# Altium schematic sheet CommonComponents.SchDoc
size Letter; SheetNumber: 7; SheetTotal: 7
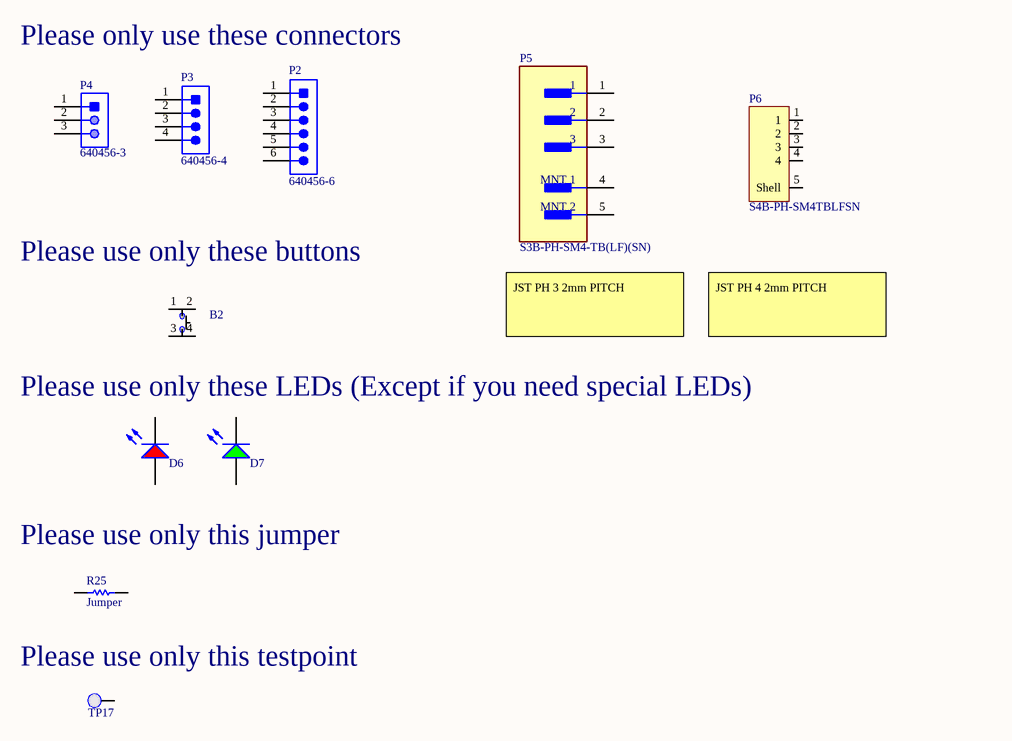
[diagram p0: CommonComponents.SchDoc]

## Parts
B2  PTS810SJK250SMTRLFS  [PTS810SJK250SMTRLFS-Footprint-1]  (value not drawn)
D6  LSM0805412V  [LED_0805_RED]  (value not drawn)
D7  LSM0805452V  [LED_0805]  (value not drawn)
P2  640456-6  [TECO-640456-6_V]
P3  640456-4  [TECO-640456-4]
P4  640456-3  [TECO-640456-3]
P5  S3B-PH-SM4-TB(LF)(SN)  [FP-S3B-PH-SM4-TB_LF_SN-MFG]
P6  S4B-PH-SM4TBLFSN  [S4B-PH-SM4TBLFSN-Footprint-1]
R25  Jumper  [0805_RES]
TP17  Test Point 0.1"  [Test Point 0.1"-Footprint-1]  (value not drawn)

## Nets

Not connected (* = marked no-connect by the designer): B2 1 2 3 4; D6 A K; D7 A K; P2 1 2 3 4 5 6; P3 1 2 3 4; P4 1 2 3; P5 1 2 3 4(MNT_1) 5(MNT_2); P6 1 2 3 4 5(Shell); R25 1 2; TP17 1(PAD)

## Notes on the sheet
- Please only use these connectors
- (near B2) Please use only these buttons
- JST PH 3 2mm PITCH
- JST PH 4 2mm PITCH
- Please use only these LEDs (Except if you need special LEDs)
- Please use only this jumper
- (near TP17) Please use only this testpoint
- Title:
- Desc:
- Size:
- Letter
- Auth:
- Proj:
- Sheet
- of
- www.seas.upenn.edu
- Electrical and Systems Engineering

## Library data of the parts
B2 = CMP-00084-1: Keypad Switch, 1 Switches, SPST, Momentary-tactile, 0.05A, 16VDC, 3.23N, Solder Terminal, Surface Mount-straight; Manufacturer Series: PTS810; Actuator Length: 0.028inch; Electrical Life: 50000Cycles; Contact Resistance: 0.5mR; Solderability: REFLOW; Actuator Travel: 0.1524mm; Actuator Color: White; Actuator Type: Pushbutton; Insulation Resistance: 100MR; Dielectric Withstand Volts: 250VACV; Reach SVHC Compliant: Yes; Terminal Finish: Silver; Switch Type: Keypad; Switch Action: MOMENTARY; RoHS Compliant: Yes; JESD-609 Code: e4; Max Operating Temperature: 85°C; Termination: Solder; Min Operating Temperature: -40°C; Mounting Technology: Surface Mount; Switch Function: SPST
D6 = CMP-00026-00001-1: Single Color LED, RED, 0805; Test Current: 20mA; Forward Voltage: 2V; RoHS Compliant: Yes
D7 = CMP-00038-3: Single Color LED, Green, 0805; Test Current: 20mA; Forward Voltage: 2V; RoHS Compliant: Yes
P2 = CMP-2000-05661-1: Male Header, Pitch 2.54 mm, 1 x 6 Position, Height 10.03 mm, Tail Length 3.56 mm, -55 to 105 degC, Bulk; Manufacturer: TE Connectivity; Contact Centerline Spacing: 0.100 / in.; Number of Contacts: 6; Current, Rating: 5 / A; Agency Approvals: CSA,UL; Material, Contact: CopperAlloy; Mounting Hole Size: 0.04 / "; Brand/Series: MTA-100Series; Pin Spacing: 0.1 / "; Mount Angle: Vertical; Contact Termination Area Plating: Tin; Angle: Straight; Primary Type: InterconnectSystem; Standards: RoHSCompliant,ELVCompliant,UL94V-0; Temperature, Operating: -55to+105 / °C; Material, Housing: Polyester; Special Features: Pinstrip; Color, Housing: White; Connector Type: MTA-100; Voltage, Rating: 250 / V; Termination: Solder; Package Reference: 640456-6; Size, Post: 0.025 / in.; Color: White; Datasheet URL: https://datasheet.ciiva.com/25618/0900766b80eb7fdd-25618163.pdf; Manufacturer URL: http://www.te.com/; Mounting Type: PCMount; Length, Pin: 0.14 / "; Type: PCBPlug; Length, Overall: 0.6 / "; Mounting Technology: ThroughHole; Number of Rows: 1; Contact Shape: Square; Contact Mating Area Plating: Tin; Datasheet Version: Rev. W, 05/2005; Number of Positions: 6; Package Description: Male Header, Pitch 2.54 mm, 1 x 6 Position, Height 10.03 mm, Tail Length 3.56 mm; Contact Plating: Tin; Length, Terminal Post: 0.14 / in.; Flammability Rating: UL94V-0
P3 = CMP-2000-05419-1: Male Header, Pitch 2.54 mm, 1 x 4 Position, Height 10.03 mm, Tail Length 3.56 mm, RoHS, Bulk; Manufacturer: TE Connectivity; Material, Housing: Polyester; Primary Type: InterconnectSystem; Mount Angle: Vertical; Color, Housing: White; Current, Rating: 5 / A; Agency Approvals: CSA,UL; Contact Termination Area Plating: Tin; Temperature, Operating: -55to+105 / degC; Standards: RoHSCompliant,ELVCompliant,UL94V-0; Number of Positions: 4; Brand/Series: MTA-100Series; Angle: Straight; Pin Spacing: 0.1 / "; Material, Contact: CopperAlloy; Connector Type: MTA-100; Special Features: Pinstrip; Mounting Hole Size: 0.04 / "; Contact Centerline Spacing: 0.100 / in.; Voltage, Rating: 250 / V; Manufacturer URL: http://www.te.com/; Length, Pin: 0.14 / "; Length, Overall: 0.4 / "; Color: White; Flammability Rating: UL94V-0; Mounting Type: PCMount; Termination: Solder; Datasheet URL: https://datasheet.ciiva.com/16286/eng-ds-82056-mta-0608-16286228.pdf; Number of Contacts: 4; Contact Shape: Square; Contact Mating Area Plating: Tin; Length, Terminal Post: 0.14 / in.; Size, Post: 0.025 / in.; Contact Plating: Tin; Type: PCBPlug; Datasheet Version: Dec-14; Number of Rows: 1
P4 = CMP-2000-05418-1: Male Header, Pitch 2.54 mm, 1 x 3 Position, Height 10.03 mm, Tail Length 3.56 mm, -55 to 105 degC; Manufacturer: TE Connectivity; Agency Approvals: CSA,UL; Angle: Straight; Number of Positions: 3; Standards: RoHSCompliant,ELVCompliant,UL94V-0; Current, Rating: 5 / A; Connector Type: MTA-100; Mount Angle: Vertical; Material, Housing: Polyester; Temperature, Operating: -55to+105 / degC; Voltage, Rating: 250 / V; Color, Housing: White; Contact Centerline Spacing: 0.100 / in.; Special Features: Pinstrip; Material, Contact: CopperAlloy; Contact Termination Area Plating: Tin; Primary Type: InterconnectSystem; Pin Spacing: 0.1 / "; Brand/Series: MTA-100Series; Mounting Hole Size: 0.04 / "; Manufacturer URL: http://www.te.com/; Datasheet URL: https://datasheet.ciiva.com/16456/eng-ds-82056-mta-0608-16456886.pdf; Flammability Rating: UL94V-0; Mounting Type: PCMount; Contact Mating Area Plating: Tin; Datasheet Version: Jun-08; Number of Rows: 1; Termination: Solder; Type: PCBPlug; Length, Pin: 0.14 / "; Color: White; Contact Plating: Tin; Contact Shape: Square; Number of Contacts: 3; Size, Post: 0.025 / in.; Length, Terminal Post: 0.14 / in.; Length, Overall: 0.3 / "
P5 = CMP-2000-07023-2: CONN HEADER SMD R/A 3POS 2MM; Current Rating: 2A; Voltage Rating: 100V; Gender: Male; Number of Contacts: 3; Insulation Resistance: 1GR; Contact Resistance: 10mR; Termination: Solder; Orientation: Right Angle; Pitch: 2mm; Insulation Color: Natural; Flammability Rating: UL94 V-0; Width: 5mm; Max Current Rating: 2A; Lead Free: Lead Free; Mount: Surface Mount; Max Operating Temperature: 85°C; Connector Type: Header; Fastening Type: Detent; Max Voltage Rating (DC): 100V; Housing Material: Polyamide; Number of Rows: 1; Housing Color: Beige; Contact Plating: Tin; Contact Shape: Square; Working Voltage: 100V; Contact Material: Copper Alloy; Contact Mating Length: 0.13inch; Contact Type: Male Pin; Max Voltage Rating (AC): 100V; Packaging: Tape and Reel; Min Operating Temperature: -25°C; Number of Positions: 3; REACH SVHC: No SVHC; Contact Finish - Mating: TIN; Color: Natural; Length: 9.9mm; Insulation Material: Nylon; Depth: 7.6mm; Material: Polyamide; Voltage Rating (AC): 100V; Series: PH; Height: 9.4mm; Number of Poles: 3; Lead Pitch: 2mm
P6 = CMP-00087-1: Connector Header, PH Series, 4 Position, Side Entry, 2.00mm, Solder, Surface Mount, Natural.
R25 = CMP-005-003861-1: Resistor Surface Mount, 0 Ohms, 0805 Footprint, 5% Tolerance 0.125W; Manufacturer P/N: RES 0805 0R 5%; Manufacturer: Various; Description in Visual: Res SMT 0 0805  5%  0.125W; PCB Package: 0805; Value: 0; Mount: SMT; Power Rating: 0.125W; Tolerance: 5%
TP17 = CMP-00086-1